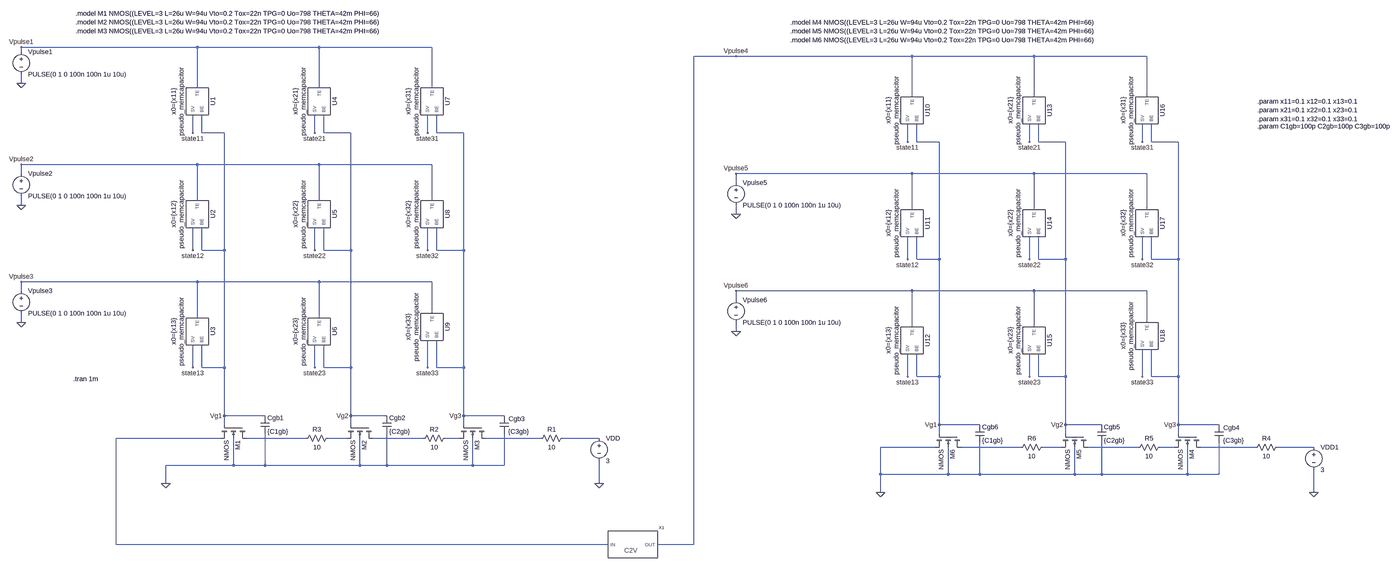
[diagram p0: schematic neuro_transistor_cascade.asc, whole sheet]
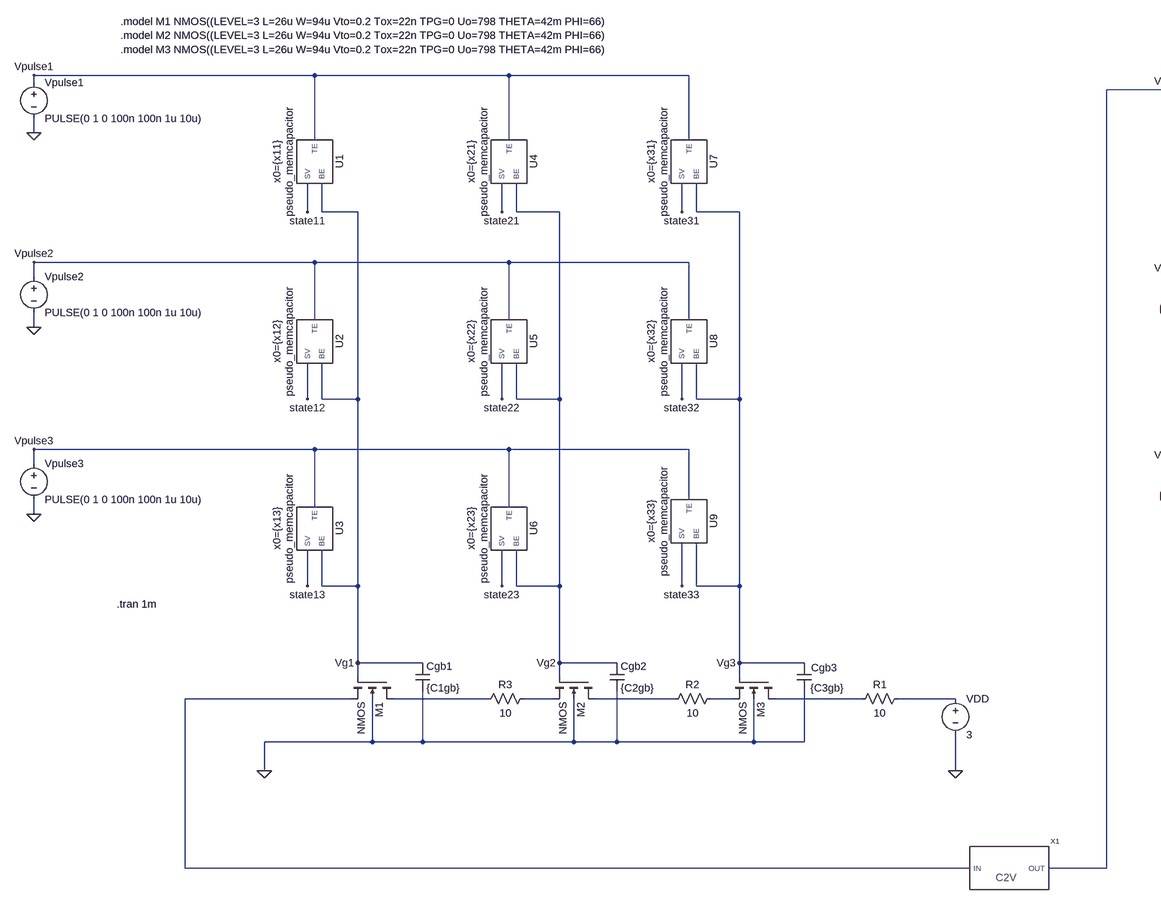
[diagram p1: schematic neuro_transistor_cascade.asc, part, row 1 of 1, column 1 of 2]
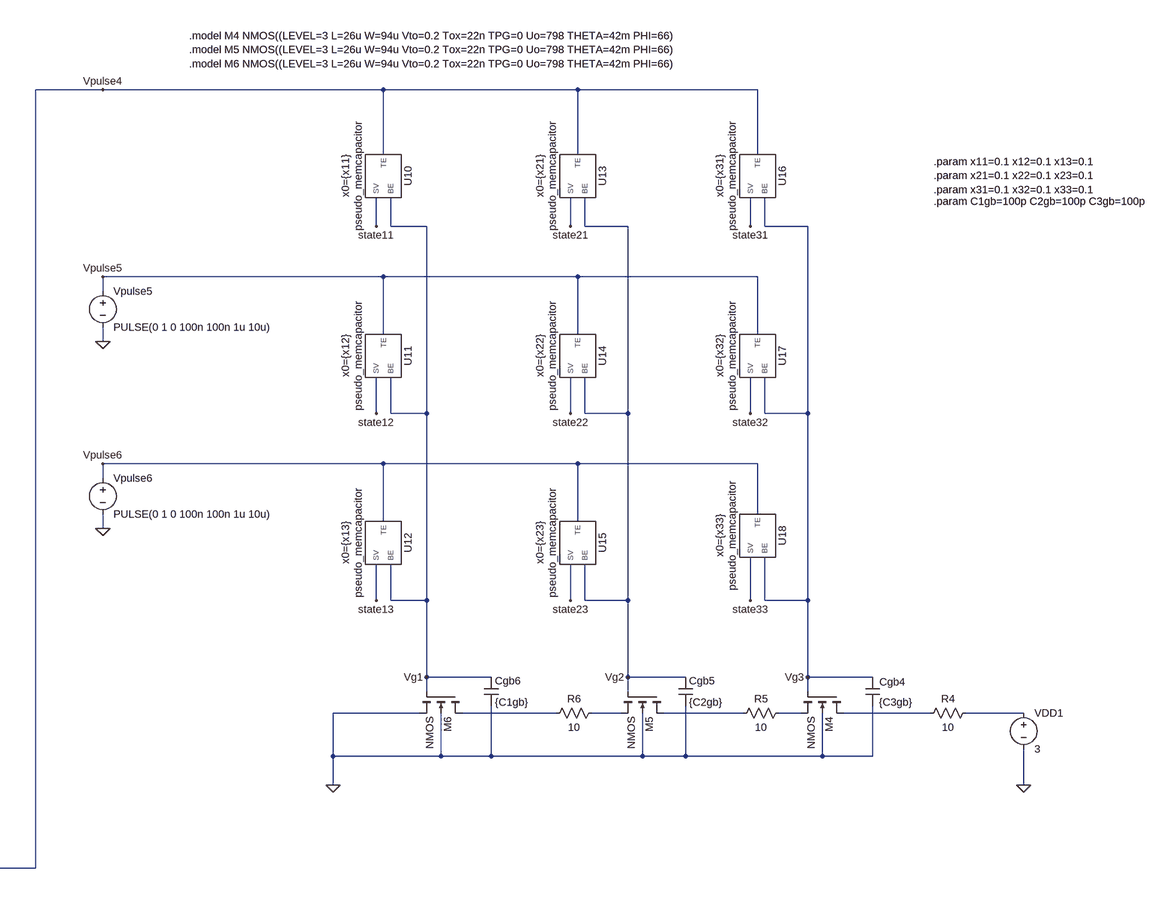
[diagram p2: schematic neuro_transistor_cascade.asc, part, row 1 of 1, column 2 of 2]
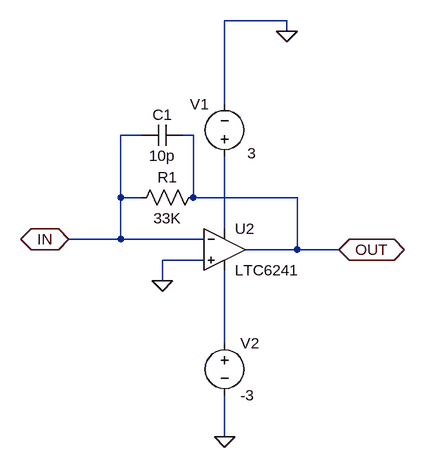
[diagram p3: sub-circuit current_to_voltage.asc]
neuro_transistor_cascade.asc, the LTspice schematic file:
Version 4
SHEET 1 5204 1764
WIRE 864 -208 240 -208
WIRE 1296 -208 864 -208
WIRE 1696 -208 1296 -208
WIRE 240 -192 240 -208
WIRE 2832 -176 2656 -176
WIRE 3456 -176 2832 -176
WIRE 3888 -176 3456 -176
WIRE 4288 -176 3888 -176
WIRE 240 -80 240 -112
WIRE 864 -64 864 -208
WIRE 1296 -64 1296 -208
WIRE 1696 -64 1696 -208
WIRE 3456 -32 3456 -176
WIRE 3888 -32 3888 -176
WIRE 4288 -32 4288 -176
WIRE 848 96 848 32
WIRE 880 96 880 32
WIRE 960 96 880 96
WIRE 1280 96 1280 32
WIRE 1312 96 1312 32
WIRE 1408 96 1312 96
WIRE 1680 96 1680 32
WIRE 1712 96 1712 32
WIRE 1808 96 1712 96
WIRE 3440 128 3440 64
WIRE 3472 128 3472 64
WIRE 3552 128 3472 128
WIRE 3872 128 3872 64
WIRE 3904 128 3904 64
WIRE 4000 128 3904 128
WIRE 4272 128 4272 64
WIRE 4304 128 4304 64
WIRE 4400 128 4304 128
WIRE 864 208 240 208
WIRE 1296 208 864 208
WIRE 1696 208 1296 208
WIRE 240 240 240 208
WIRE 3456 240 2832 240
WIRE 3888 240 3456 240
WIRE 4288 240 3888 240
WIRE 2832 272 2832 240
WIRE 864 336 864 208
WIRE 1296 336 1296 208
WIRE 1696 336 1696 208
WIRE 240 352 240 320
WIRE 3456 368 3456 240
WIRE 3888 368 3888 240
WIRE 4288 368 4288 240
WIRE 2832 384 2832 352
WIRE 848 512 848 432
WIRE 880 512 880 432
WIRE 960 512 960 96
WIRE 960 512 880 512
WIRE 1280 512 1280 432
WIRE 1312 512 1312 432
WIRE 1408 512 1408 96
WIRE 1408 512 1312 512
WIRE 1680 512 1680 432
WIRE 1712 512 1712 432
WIRE 1808 512 1808 96
WIRE 1808 512 1712 512
WIRE 3440 544 3440 464
WIRE 3472 544 3472 464
WIRE 3552 544 3552 128
WIRE 3552 544 3472 544
WIRE 3872 544 3872 464
WIRE 3904 544 3904 464
WIRE 4000 544 4000 128
WIRE 4000 544 3904 544
WIRE 4272 544 4272 464
WIRE 4304 544 4304 464
WIRE 4400 544 4400 128
WIRE 4400 544 4304 544
WIRE 864 624 240 624
WIRE 1296 624 864 624
WIRE 1696 624 1296 624
WIRE 240 656 240 624
WIRE 3456 656 2832 656
WIRE 3888 656 3456 656
WIRE 4288 656 3888 656
WIRE 2832 688 2832 656
WIRE 1696 736 1696 624
WIRE 864 752 864 624
WIRE 1296 752 1296 624
WIRE 240 768 240 736
WIRE 4288 768 4288 656
WIRE 3456 784 3456 656
WIRE 3888 784 3888 656
WIRE 2832 800 2832 768
WIRE 848 928 848 848
WIRE 880 928 880 848
WIRE 960 928 960 512
WIRE 960 928 880 928
WIRE 1280 928 1280 848
WIRE 1312 928 1312 848
WIRE 1408 928 1408 512
WIRE 1408 928 1312 928
WIRE 1680 928 1680 832
WIRE 1712 928 1712 832
WIRE 1808 928 1808 512
WIRE 1808 928 1712 928
WIRE 3440 960 3440 880
WIRE 3472 960 3472 880
WIRE 3552 960 3552 544
WIRE 3552 960 3472 960
WIRE 3872 960 3872 880
WIRE 3904 960 3904 880
WIRE 4000 960 4000 544
WIRE 4000 960 3904 960
WIRE 4272 960 4272 864
WIRE 4304 960 4304 864
WIRE 4400 960 4400 544
WIRE 4400 960 4304 960
WIRE 960 1152 960 928
WIRE 1104 1152 960 1152
WIRE 1408 1152 1408 928
WIRE 1536 1152 1408 1152
WIRE 1808 1152 1808 928
WIRE 1952 1152 1808 1152
WIRE 960 1184 960 1152
WIRE 1408 1184 1408 1152
WIRE 1808 1184 1808 1152
WIRE 3552 1184 3552 960
WIRE 3696 1184 3552 1184
WIRE 4000 1184 4000 960
WIRE 4128 1184 4000 1184
WIRE 4400 1184 4400 960
WIRE 4544 1184 4400 1184
WIRE 3552 1216 3552 1184
WIRE 4000 1216 4000 1184
WIRE 4400 1216 4400 1184
WIRE 944 1232 576 1232
WIRE 1248 1232 1040 1232
WIRE 1392 1232 1328 1232
WIRE 1664 1232 1488 1232
WIRE 1792 1232 1744 1232
WIRE 2080 1232 1888 1232
WIRE 2288 1232 2160 1232
WIRE 3536 1264 3344 1264
WIRE 3840 1264 3632 1264
WIRE 3984 1264 3920 1264
WIRE 4256 1264 4080 1264
WIRE 4384 1264 4336 1264
WIRE 4672 1264 4480 1264
WIRE 4880 1264 4752 1264
WIRE 992 1328 992 1232
WIRE 992 1328 752 1328
WIRE 1104 1328 1104 1216
WIRE 1104 1328 992 1328
WIRE 1440 1328 1440 1232
WIRE 1440 1328 1104 1328
WIRE 1536 1328 1536 1216
WIRE 1536 1328 1440 1328
WIRE 1840 1328 1840 1232
WIRE 1840 1328 1536 1328
WIRE 1952 1328 1952 1216
WIRE 1952 1328 1840 1328
WIRE 3344 1360 3344 1264
WIRE 3584 1360 3584 1264
WIRE 3584 1360 3344 1360
WIRE 3696 1360 3696 1248
WIRE 3696 1360 3584 1360
WIRE 4032 1360 4032 1264
WIRE 4032 1360 3696 1360
WIRE 4128 1360 4128 1248
WIRE 4128 1360 4032 1360
WIRE 4432 1360 4432 1264
WIRE 4432 1360 4128 1360
WIRE 4544 1360 4544 1248
WIRE 4544 1360 4432 1360
WIRE 752 1392 752 1328
WIRE 2288 1392 2288 1312
WIRE 3344 1424 3344 1360
WIRE 4880 1424 4880 1344
WIRE 576 1712 576 1232
WIRE 2320 1712 576 1712
WIRE 2656 1712 2656 -176
WIRE 2656 1712 2496 1712
FLAG 240 -80 0
FLAG 2288 1392 0
FLAG 848 96 state11
FLAG 1808 1152 Vg3
FLAG 240 -208 Vpulse1
FLAG 848 512 state12
FLAG 848 928 state13
FLAG 240 352 0
FLAG 240 768 0
FLAG 240 208 Vpulse2
FLAG 240 624 Vpulse3
FLAG 1408 1152 Vg2
FLAG 960 1152 Vg1
FLAG 1280 96 state21
FLAG 1280 512 state22
FLAG 1280 928 state23
FLAG 1680 96 state31
FLAG 1680 512 state32
FLAG 1680 928 state33
FLAG 752 1392 0
FLAG 4880 1424 0
FLAG 3440 128 state11
FLAG 4400 1184 Vg3
FLAG 3440 544 state12
FLAG 3440 960 state13
FLAG 2832 384 0
FLAG 2832 800 0
FLAG 2832 240 Vpulse5
FLAG 2832 656 Vpulse6
FLAG 4000 1184 Vg2
FLAG 3552 1184 Vg1
FLAG 3872 128 state21
FLAG 3872 544 state22
FLAG 3872 960 state23
FLAG 4272 128 state31
FLAG 4272 544 state32
FLAG 4272 960 state33
FLAG 3344 1424 0
FLAG 2832 -176 Vpulse4
SYMBOL voltage 240 -208 R0
WINDOW 123 0 0 Left 0
WINDOW 39 0 0 Left 0
SYMATTR InstName Vpulse1
SYMATTR Value PULSE(0 1 0 100n 100n 1u 10u)
SYMBOL voltage 2288 1216 R0
SYMATTR InstName VDD
SYMATTR Value 3
SYMBOL nmos4 1888 1184 R90
SYMATTR InstName M3
SYMBOL cap 1936 1152 R0
WINDOW 0 31 11 Left 2
WINDOW 3 30 56 Left 2
SYMATTR InstName Cgb3
SYMATTR Value {C3gb}
SYMBOL voltage 240 224 R0
SYMATTR InstName Vpulse2
SYMATTR Value PULSE(0 1 0 100n 100n 1u 10u)
SYMBOL voltage 240 640 R0
SYMATTR InstName Vpulse3
SYMATTR Value PULSE(0 1 0 100n 100n 1u 10u)
SYMBOL pseudo_memcapacitor 864 -16 R90
WINDOW 123 0 68 Top 2
SYMATTR Value2 x0={x11}
SYMATTR InstName U1
SYMBOL pseudo_memcapacitor 864 384 R90
WINDOW 123 0 68 Top 2
SYMATTR Value2 x0={x12}
SYMATTR InstName U2
SYMBOL pseudo_memcapacitor 864 800 R90
WINDOW 123 0 68 Top 2
SYMATTR Value2 x0={x13}
SYMATTR InstName U3
SYMBOL pseudo_memcapacitor 1296 -16 R90
WINDOW 123 0 68 Top 2
SYMATTR Value2 x0={x21}
SYMATTR InstName U4
SYMBOL pseudo_memcapacitor 1296 384 R90
WINDOW 123 0 68 Top 2
SYMATTR Value2 x0={x22}
SYMATTR InstName U5
SYMBOL pseudo_memcapacitor 1296 800 R90
WINDOW 123 0 68 Top 2
SYMATTR Value2 x0={x23}
SYMATTR InstName U6
SYMBOL pseudo_memcapacitor 1696 -16 R90
WINDOW 123 0 68 Top 2
SYMATTR Value2 x0={x31}
SYMATTR InstName U7
SYMBOL pseudo_memcapacitor 1696 384 R90
WINDOW 123 0 68 Top 2
SYMATTR Value2 x0={x32}
SYMATTR InstName U8
SYMBOL pseudo_memcapacitor 1696 784 R90
WINDOW 123 0 68 Top 2
SYMATTR Value2 x0={x33}
SYMATTR InstName U9
SYMBOL nmos4 1488 1184 R90
SYMATTR InstName M2
SYMBOL nmos4 1040 1184 R90
SYMATTR InstName M1
SYMBOL cap 1520 1152 R0
SYMATTR InstName Cgb2
SYMATTR Value {C2gb}
SYMBOL cap 1088 1152 R0
SYMATTR InstName Cgb1
SYMATTR Value {C1gb}
SYMBOL res 2176 1216 R90
WINDOW 0 0 56 VBottom 2
WINDOW 3 32 56 VTop 2
SYMATTR InstName R1
SYMATTR Value 10
SYMBOL res 1760 1216 R90
WINDOW 0 0 56 VBottom 2
WINDOW 3 32 56 VTop 2
SYMATTR InstName R2
SYMATTR Value 10
SYMBOL res 1344 1216 R90
WINDOW 0 0 56 VBottom 2
WINDOW 3 32 56 VTop 2
SYMATTR InstName R3
SYMATTR Value 10
SYMBOL voltage 4880 1248 R0
SYMATTR InstName VDD1
SYMATTR Value 3
SYMBOL nmos4 4480 1216 R90
SYMATTR InstName M4
SYMBOL cap 4528 1184 R0
WINDOW 0 31 11 Left 2
WINDOW 3 30 56 Left 2
SYMATTR InstName Cgb4
SYMATTR Value {C3gb}
SYMBOL voltage 2832 256 R0
SYMATTR InstName Vpulse5
SYMATTR Value PULSE(0 1 0 100n 100n 1u 10u)
SYMBOL voltage 2832 672 R0
SYMATTR InstName Vpulse6
SYMATTR Value PULSE(0 1 0 100n 100n 1u 10u)
SYMBOL pseudo_memcapacitor 3456 16 R90
WINDOW 123 0 68 Top 2
SYMATTR Value2 x0={x11}
SYMATTR InstName U10
SYMBOL pseudo_memcapacitor 3456 416 R90
WINDOW 123 0 68 Top 2
SYMATTR Value2 x0={x12}
SYMATTR InstName U11
SYMBOL pseudo_memcapacitor 3456 832 R90
WINDOW 123 0 68 Top 2
SYMATTR Value2 x0={x13}
SYMATTR InstName U12
SYMBOL pseudo_memcapacitor 3888 16 R90
WINDOW 123 0 68 Top 2
SYMATTR Value2 x0={x21}
SYMATTR InstName U13
SYMBOL pseudo_memcapacitor 3888 416 R90
WINDOW 123 0 68 Top 2
SYMATTR Value2 x0={x22}
SYMATTR InstName U14
SYMBOL pseudo_memcapacitor 3888 832 R90
WINDOW 123 0 68 Top 2
SYMATTR Value2 x0={x23}
SYMATTR InstName U15
SYMBOL pseudo_memcapacitor 4288 16 R90
WINDOW 123 0 68 Top 2
SYMATTR Value2 x0={x31}
SYMATTR InstName U16
SYMBOL pseudo_memcapacitor 4288 416 R90
WINDOW 123 0 68 Top 2
SYMATTR Value2 x0={x32}
SYMATTR InstName U17
SYMBOL pseudo_memcapacitor 4288 816 R90
WINDOW 123 0 68 Top 2
SYMATTR Value2 x0={x33}
SYMATTR InstName U18
SYMBOL nmos4 4080 1216 R90
SYMATTR InstName M5
SYMBOL nmos4 3632 1216 R90
SYMATTR InstName M6
SYMBOL cap 4112 1184 R0
SYMATTR InstName Cgb5
SYMATTR Value {C2gb}
SYMBOL cap 3680 1184 R0
SYMATTR InstName Cgb6
SYMATTR Value {C1gb}
SYMBOL res 4768 1248 R90
WINDOW 0 0 56 VBottom 2
WINDOW 3 32 56 VTop 2
SYMATTR InstName R4
SYMATTR Value 10
SYMBOL res 4352 1248 R90
WINDOW 0 0 56 VBottom 2
WINDOW 3 32 56 VTop 2
SYMATTR InstName R5
SYMATTR Value 10
SYMBOL res 3936 1248 R90
WINDOW 0 0 56 VBottom 2
WINDOW 3 32 56 VTop 2
SYMATTR InstName R6
SYMATTR Value 10
SYMBOL current_to_voltage 2400 1712 R0
SYMATTR InstName X1
TEXT 424 968 Left 2 !.tran 1m
TEXT 432 -328 Left 2 !.model M1 NMOS((LEVEL=3 L=26u W=94u Vto=0.2 Tox=22n TPG=0 Uo=798 THETA=42m PHI=66)\n.model M2 NMOS((LEVEL=3 L=26u W=94u Vto=0.2 Tox=22n TPG=0 Uo=798 THETA=42m PHI=66)\n.model M3 NMOS((LEVEL=3 L=26u W=94u Vto=0.2 Tox=22n TPG=0 Uo=798 THETA=42m PHI=66)
TEXT 3024 -296 Left 2 !.model M4 NMOS((LEVEL=3 L=26u W=94u Vto=0.2 Tox=22n TPG=0 Uo=798 THETA=42m PHI=66)\n.model M5 NMOS((LEVEL=3 L=26u W=94u Vto=0.2 Tox=22n TPG=0 Uo=798 THETA=42m PHI=66)\n.model M6 NMOS((LEVEL=3 L=26u W=94u Vto=0.2 Tox=22n TPG=0 Uo=798 THETA=42m PHI=66)
TEXT 4680 -16 Left 2 !.param x11=0.1 x12=0.1 x13=0.1\n.param x21=0.1 x22=0.1 x23=0.1\n.param x31=0.1 x32=0.1 x33=0.1
TEXT 4680 72 Left 2 !.param C1gb=100p C2gb=100p C3gb=100p

current_to_voltage.asc, the sub-circuit schematic file:
Version 4
SHEET 1 880 680
WIRE 320 -192 224 -192
WIRE 320 -176 320 -192
WIRE 224 -64 224 -192
WIRE 96 -16 64 -16
WIRE 176 -16 160 -16
WIRE 64 80 64 -16
WIRE 96 80 64 80
WIRE 176 80 176 -16
WIRE 336 80 176 80
WIRE 224 128 224 16
WIRE 64 144 64 80
WIRE 64 144 -16 144
WIRE 192 144 64 144
WIRE 336 160 336 80
WIRE 336 160 256 160
WIRE 400 160 336 160
WIRE 192 176 128 176
WIRE 128 208 128 176
WIRE 224 304 224 192
WIRE 224 448 224 384
FLAG 128 208 0
FLAG 320 -176 0
FLAG 224 448 0
FLAG -16 144 IN
IOPIN -16 144 BiDir
FLAG 400 160 OUT
IOPIN 400 160 BiDir
SYMBOL voltage 224 32 R180
WINDOW 0 24 96 Left 2
WINDOW 3 -49 20 Left 2
WINDOW 123 0 0 Left 0
WINDOW 39 0 0 Left 0
SYMATTR InstName V1
SYMATTR Value 3
SYMBOL voltage 224 288 R0
WINDOW 123 0 0 Left 0
WINDOW 39 0 0 Left 0
SYMATTR InstName V2
SYMATTR Value -3
SYMBOL res 192 64 R90
WINDOW 0 0 56 VBottom 2
WINDOW 3 32 56 VTop 2
SYMATTR InstName R1
SYMATTR Value 33K
SYMBOL OpAmps\\LTC6241 224 160 R0
SYMATTR InstName U2
SYMBOL cap 160 -32 R90
WINDOW 0 0 32 VBottom 2
WINDOW 3 32 32 VTop 2
SYMATTR InstName C1
SYMATTR Value 10p

The netlist it stands for:
* neuro_transistor_cascade.asc
Vpulse1 Vpulse1 0 PULSE(0 1 0 100n 100n 1u 10u)
VDD N007 0 3
M3 N006 Vg3 N005 0 NMOS
Cgb3 Vg3 0 {C3gb}
Vpulse2 Vpulse2 0 PULSE(0 1 0 100n 100n 1u 10u)
Vpulse3 Vpulse3 0 PULSE(0 1 0 100n 100n 1u 10u)
XU1 Vpulse1 Vg1 state11 pseudo_memcapacitor x0={x11}  ; pins TE BE SV
XU2 Vpulse2 Vg1 state12 pseudo_memcapacitor x0={x12}  ; pins TE BE SV
XU3 Vpulse3 Vg1 state13 pseudo_memcapacitor x0={x13}  ; pins TE BE SV
XU4 Vpulse1 Vg2 state21 pseudo_memcapacitor x0={x21}  ; pins TE BE SV
XU5 Vpulse2 Vg2 state22 pseudo_memcapacitor x0={x22}  ; pins TE BE SV
XU6 Vpulse3 Vg2 state23 pseudo_memcapacitor x0={x23}  ; pins TE BE SV
XU7 Vpulse1 Vg3 state31 pseudo_memcapacitor x0={x31}  ; pins TE BE SV
XU8 Vpulse2 Vg3 state32 pseudo_memcapacitor x0={x32}  ; pins TE BE SV
XU9 Vpulse3 Vg3 state33 pseudo_memcapacitor x0={x33}  ; pins TE BE SV
M2 N004 Vg2 N003 0 NMOS
M1 N002 Vg1 N001 0 NMOS
Cgb2 Vg2 0 {C2gb}
Cgb1 Vg1 0 {C1gb}
R1 N007 N006 10
R2 N005 N004 10
R3 N003 N002 10
VDD1 N013 0 3
M4 N012 Vg3 N011 0 NMOS
Cgb4 Vg3 0 {C3gb}
Vpulse5 Vpulse5 0 PULSE(0 1 0 100n 100n 1u 10u)
Vpulse6 Vpulse6 0 PULSE(0 1 0 100n 100n 1u 10u)
XU10 Vpulse4 Vg1 state11 pseudo_memcapacitor x0={x11}  ; pins TE BE SV
XU11 Vpulse5 Vg1 state12 pseudo_memcapacitor x0={x12}  ; pins TE BE SV
XU12 Vpulse6 Vg1 state13 pseudo_memcapacitor x0={x13}  ; pins TE BE SV
XU13 Vpulse4 Vg2 state21 pseudo_memcapacitor x0={x21}  ; pins TE BE SV
XU14 Vpulse5 Vg2 state22 pseudo_memcapacitor x0={x22}  ; pins TE BE SV
XU15 Vpulse6 Vg2 state23 pseudo_memcapacitor x0={x23}  ; pins TE BE SV
XU16 Vpulse4 Vg3 state31 pseudo_memcapacitor x0={x31}  ; pins TE BE SV
XU17 Vpulse5 Vg3 state32 pseudo_memcapacitor x0={x32}  ; pins TE BE SV
XU18 Vpulse6 Vg3 state33 pseudo_memcapacitor x0={x33}  ; pins TE BE SV
M5 N010 Vg2 N009 0 NMOS
M6 N008 Vg1 0 0 NMOS
Cgb5 Vg2 0 {C2gb}
Cgb6 Vg1 0 {C1gb}
R4 N013 N012 10
R5 N011 N010 10
R6 N009 N008 10
XX1 N001 Vpulse4 current_to_voltage params: current_to_voltage

* block symbol definitions
.subckt current_to_voltage IN OUT
V1 N001 0 3
V2 N002 0 -3
R1 OUT IN 33K
XU2 0 IN N001 N002 OUT LTC6241  ; pins In+ In- V+ V- OUT
C1 OUT IN 10p
.ends current_to_voltage

.model NMOS NMOS
.model PMOS PMOS
.lib standard.mos
.tran 1m
.model M1 NMOS((LEVEL=3 L=26u W=94u Vto=0.2 Tox=22n TPG=0 Uo=798 THETA=42m PHI=66)
.model M2 NMOS((LEVEL=3 L=26u W=94u Vto=0.2 Tox=22n TPG=0 Uo=798 THETA=42m PHI=66)
.model M3 NMOS((LEVEL=3 L=26u W=94u Vto=0.2 Tox=22n TPG=0 Uo=798 THETA=42m PHI=66)
.model M4 NMOS((LEVEL=3 L=26u W=94u Vto=0.2 Tox=22n TPG=0 Uo=798 THETA=42m PHI=66)
.model M5 NMOS((LEVEL=3 L=26u W=94u Vto=0.2 Tox=22n TPG=0 Uo=798 THETA=42m PHI=66)
.model M6 NMOS((LEVEL=3 L=26u W=94u Vto=0.2 Tox=22n TPG=0 Uo=798 THETA=42m PHI=66)
.param x11=0.1 x12=0.1 x13=0.1
.param x21=0.1 x22=0.1 x23=0.1
.param x31=0.1 x32=0.1 x33=0.1
.param C1gb=100p C2gb=100p C3gb=100p
.lib pseudo_memcapacitor.cir
.lib ./current_to_voltage.asc
.lib LTC4.lib
.backanno
.end